# Altium schematic sheet Carrier_Board.SchDoc
size A4
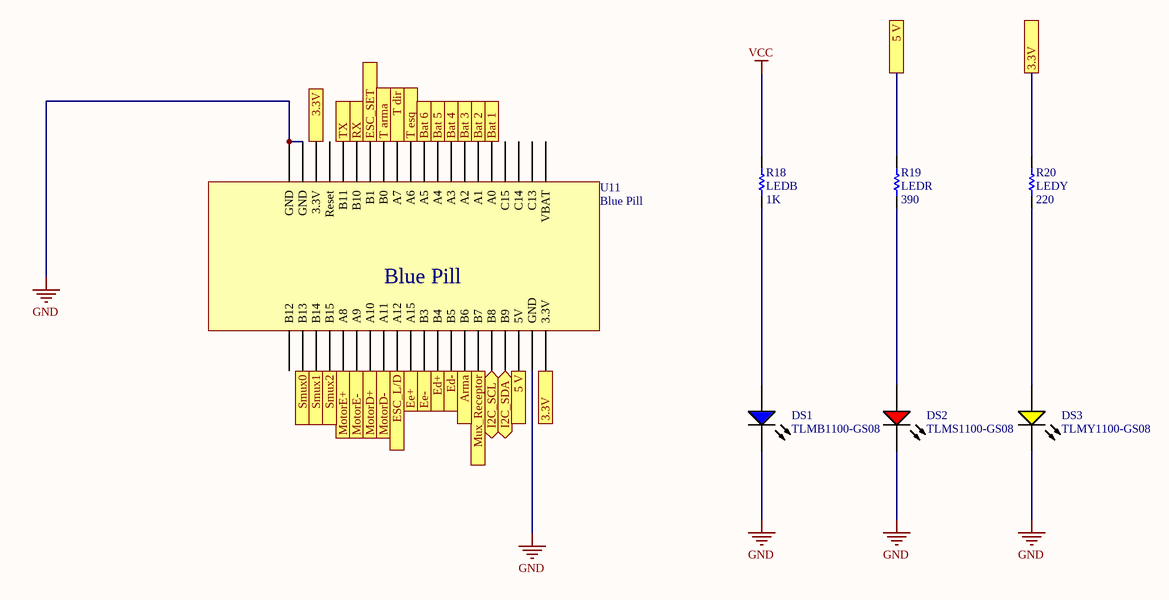
[diagram p0: Carrier_Board.SchDoc]

## Parts
DS1  TLMB1100-GS08  [VISH-TLMX1100-2_V]
DS2  TLMS1100-GS08  [VISH-TLMX1100_V]
DS3  TLMY1100-GS08  [VISH-TLMX1100-2_V]
R18  LEDB  value 1K  [AXIAL-0.3]
R19  LEDR  value 390  [AXIAL-0.3]
R20  LEDY  value 220  [AXIAL-0.3]
U11  Blue Pill  [blue pill]

## Ports
3.3V, 5 V, Arma (out), Bat 1 (in), Bat 2 (in), Bat 3 (in), Bat 4 (in), Bat 5 (in), Bat 6 (in), Ed+ (in), Ed- (in), Ee+ (in), Ee- (in), ESC_L/D (out), ESC_SET (out), I2C_SCL (bidir), I2C_SDA (bidir), MotorD+ (out), MotorD- (out), MotorE+ (out), MotorE- (out), Mux_Receptor (in), RX, Smux0 (out), Smux1 (out), Smux2 (out), T arma (in), T dir (in), T esq (in), TX

## Nets
GND: DS1.2(K) DS2.2(K) DS3.2(K) U11.?19(GND) U11.?20(GND) U11.?39(GND)
VCC: R18.2
3.3V: R20.2 U11.?2(3.3V) U11.?40(3.3V) ; port 3.3V
5 V: R19.2 U11.?38(5V) ; port 5 V
Arma: U11.?34(B6) ; port Arma
Bat 1: U11.?6(A0) ; port Bat 1
Bat 2: U11.?7(A1) ; port Bat 2
Bat 3: U11.?8(A2) ; port Bat 3
Bat 4: U11.?9(A3) ; port Bat 4
Bat 5: U11.?10(A4) ; port Bat 5
Bat 6: U11.?11(A5) ; port Bat 6
Ed+: U11.?32(B4) ; port Ed+
Ed-: U11.?33(B5) ; port Ed-
Ee+: U11.?30(A15) ; port Ee+
Ee-: U11.?31(B3) ; port Ee-
ESC_L/D: U11.?29(A12) ; port ESC_L/D
ESC_SET: U11.?15(B1) ; port ESC_SET
I2C_SCL: U11.?36(B8) ; port I2C_SCL
I2C_SDA: U11.?37(B9) ; port I2C_SDA
MotorD+: U11.?27(A10) ; port MotorD+
MotorD-: U11.?28(A11) ; port MotorD-
MotorE+: U11.?25(A8) ; port MotorE+
MotorE-: U11.?26(A9) ; port MotorE-
Mux_Receptor: U11.?35(B7) ; port Mux_Receptor
RX: U11.?16(B10) ; port RX
Smux0: U11.?22(B13) ; port Smux0
Smux1: U11.?23(B14) ; port Smux1
Smux2: U11.?24(B15) ; port Smux2
T arma: U11.?14(B0) ; port T arma
T dir: U11.?13(A7) ; port T dir
T esq: U11.?12(A6) ; port T esq
TX: U11.?17(B11) ; port TX
NetDS1_1: DS1.1(A) R18.1
NetDS2_1: DS2.1(A) R19.1
NetDS3_1: DS3.1(A) R20.1

Not connected (* = marked no-connect by the designer): U11 ?1(VBAT) ?3(C13) ?4(C14) ?5(C15) ?18(Reset) ?21(B12)

## Library data of the parts
DS1 = CMP-1666-00028-1: Blue LED, 10 mA, 3.9 V, -40 to 100 degC, 2-Pin SMD (0603), RoHS, Tape and Reel; Tolerance: 10%; Voltage Rating: 100 V; Capacitance: 10 nF; Type (Capacitors): X7R; Case\Package: Radial; ComponentLink1Description: Manufacturer URL; REACH SVHC: No SVHC; Package Quantity: 500; PackageDescription: 2-Pin Surface Mount Device, Body 1.6 x 0.8 mm; Pins: 2; ComponentLink2URL: http://download.siliconexpert.com/pdfs/2016/8/7/12/43/26/667/vsh_/manual/379263299541529tlmb1100.pdf; RoHSCompliant: true; Lead Pitch: 2.54 mm; Height: 2.54 mm; DatasheetVersion: Rev. 2.7, 03/2016; Length: 5.33 mm; ComponentLink1URL: http://www.vishay.com/; Min Operating Temperature: -55 degC; PackageReference: 0603; Packaging: Bulk; ComponentLink2Description: Datasheet; Max Operating Temperature: 125 degC; Radiation Hardening: No; Width: 3.81 mm; Mount: Through Hole
DS2 = CMP-1666-00027-1: LED, RED, 2.1 V, -40 to 100 degC, 2-Pin SMD (0603), RoHS, Tape and Reel; Type (Capacitors): C0G; Resistance: 100000000000 Ohm; Capacitance: 12 pF; Voltage Rating: 50 V; Tolerance: 5%; Min Operating Temperature: -55degC; REACH SVHC: No SVHC; ComponentLink2Description: Datasheet; ComponentLink1URL: http://www.vishay.com/; Width: 0.8 mm; Package Quantity: 4000; PackageReference: TLMX1100; ComponentLink2URL: http://www.vishay.com/docs/83173/tlmb1100.pdf; Case/Package: 0603; Case Code (Metric): 1608; Packaging: Tape and Reel; Pins: 2; ComponentLink1Description: Manufacturer URL; Max Operating Temperature: 125degC; Height: 0.8 mm; Length: 1.6 mm; Mount: Surface Mount; PackageDescription: 2-Pin Surface Mount Device, Body 1.6 x 0.8 mm; DatasheetVersion: Rev. 2.7, 03/2016; Case Code (Imperial): 0603; Voltage Rating (DC): 50 V; RoHSCompliant: True; Radiation Hardening: No
DS3 = CMP-1666-00030-1: Yellow LED, 20 mA, 2.1 V, -40 to 100 degC, 2-Pin SMD (0603), RoHS, Tape and Reel; ComponentLink2Description: Datasheet; ComponentLink2URL: http://download.siliconexpert.com/pdfs/2016/8/7/12/43/26/667/vsh_/manual/379263299541529tlmb1100.pdf; ComponentLink1Description: Manufacturer URL; PackageDescription: 2-Pin Surface Mount Device, Body 1.6 x 0.8 mm; DatasheetVersion: Rev. 2.7, 03/2016; ComponentLink1URL: http://www.vishay.com/; PackageReference: 0603
R18-R20 = Res1: Resistor; Published: 8-Jun-2000; LatestRevisionDate: 17-Jul-2002; LatestRevisionNote: Re-released for DXP Platform.; PackageReference: AXIAL-0.3; Publisher: Altium Limited; PackageDescription: Axial Device, Thru-Hole; 2 Leads; 0.3 in Pin Spacing